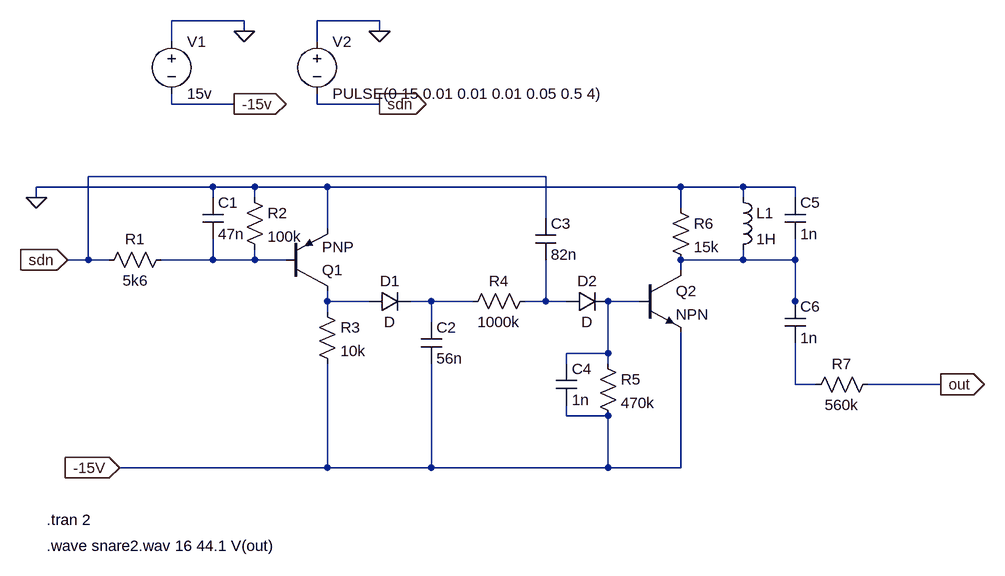
[diagram p0: schematic snare2.asc]
snare2.asc, the LTspice schematic file:
Version 4
SHEET 1 1168 680
WIRE 0 -176 -112 -176
WIRE 208 -176 112 -176
WIRE 0 -160 0 -176
WIRE 208 -160 208 -176
WIRE -112 -144 -112 -176
WIRE 112 -144 112 -176
WIRE -112 -48 -112 -64
WIRE -16 -48 -112 -48
WIRE 112 -48 112 -64
WIRE 208 -48 112 -48
WIRE 464 64 -240 64
WIRE -48 80 -320 80
WIRE 16 80 -48 80
WIRE 128 80 16 80
WIRE 672 80 128 80
WIRE 768 80 672 80
WIRE 848 80 768 80
WIRE -320 96 -320 80
WIRE -48 96 -48 80
WIRE 16 96 16 80
WIRE 768 96 768 80
WIRE 848 96 848 80
WIRE 672 112 672 80
WIRE 464 128 464 64
WIRE 128 144 128 80
WIRE -240 192 -240 64
WIRE -240 192 -272 192
WIRE -208 192 -240 192
WIRE -48 192 -48 160
WIRE -48 192 -128 192
WIRE 16 192 16 176
WIRE 16 192 -48 192
WIRE 64 192 16 192
WIRE 768 192 768 176
WIRE 768 192 672 192
WIRE 848 192 848 160
WIRE 848 192 768 192
WIRE 672 208 672 192
WIRE 128 256 128 240
WIRE 192 256 128 256
WIRE 288 256 256 256
WIRE 352 256 288 256
WIRE 464 256 464 192
WIRE 464 256 432 256
WIRE 496 256 464 256
WIRE 608 256 560 256
WIRE 848 256 848 192
WIRE 128 272 128 256
WIRE 848 272 848 256
WIRE 288 288 288 256
WIRE 560 336 560 256
WIRE 560 336 496 336
WIRE 496 352 496 336
WIRE 560 352 560 336
WIRE 848 384 848 320
WIRE 880 384 848 384
WIRE 1072 384 960 384
WIRE 496 432 496 416
WIRE 560 432 496 432
WIRE 128 512 128 352
WIRE 128 512 -192 512
WIRE 288 512 288 352
WIRE 288 512 128 512
WIRE 560 512 560 432
WIRE 560 512 288 512
WIRE 672 512 672 304
WIRE 672 512 560 512
FLAG -272 192 sdn
IOPIN -272 192 In
FLAG -320 96 0
FLAG -192 512 -15V
IOPIN -192 512 In
FLAG 0 -160 0
FLAG -16 -48 -15v
IOPIN -16 -48 Out
FLAG 208 -160 0
FLAG 208 -48 sdn
IOPIN 208 -48 Out
FLAG 1072 384 out
IOPIN 1072 384 Out
SYMBOL res -112 176 R90
WINDOW 0 0 56 VBottom 2
WINDOW 3 32 56 VTop 2
SYMATTR InstName R1
SYMATTR Value 5k6
SYMBOL cap -64 96 R0
SYMATTR InstName C1
SYMATTR Value 47n
SYMBOL res 0 80 R0
SYMATTR InstName R2
SYMATTR Value 100k
SYMBOL pnp 64 240 M180
SYMATTR InstName Q1
SYMBOL res 112 256 R0
SYMATTR InstName R3
SYMATTR Value 10k
SYMBOL diode 192 272 R270
WINDOW 0 32 32 VTop 2
WINDOW 3 0 32 VBottom 2
SYMATTR InstName D1
SYMBOL cap 272 288 R0
SYMATTR InstName C2
SYMATTR Value 56n
SYMBOL res 448 240 R90
WINDOW 0 0 56 VBottom 2
WINDOW 3 32 56 VTop 2
SYMATTR InstName R4
SYMATTR Value 1000k
SYMBOL cap 448 128 R0
SYMATTR InstName C3
SYMATTR Value 82n
SYMBOL diode 496 272 R270
WINDOW 0 32 32 VTop 2
WINDOW 3 0 32 VBottom 2
SYMATTR InstName D2
SYMBOL res 544 336 R0
SYMATTR InstName R5
SYMATTR Value 470k
SYMBOL cap 480 352 R0
SYMATTR InstName C4
SYMATTR Value 1n
SYMBOL npn 608 208 R0
SYMATTR InstName Q2
SYMBOL res 656 96 R0
SYMATTR InstName R6
SYMATTR Value 15k
SYMBOL ind 752 80 R0
SYMATTR InstName L1
SYMATTR Value 1H
SYMBOL cap 832 96 R0
SYMATTR InstName C5
SYMATTR Value 1n
SYMBOL voltage -112 -160 R0
WINDOW 123 0 0 Left 0
WINDOW 39 0 0 Left 0
SYMATTR InstName V1
SYMATTR Value 15v
SYMBOL voltage 112 -160 R0
WINDOW 123 0 0 Left 0
WINDOW 39 0 0 Left 0
SYMATTR InstName V2
SYMATTR Value PULSE(0 15 0.01 0.01 0.01 0.05 0.5 4)
SYMBOL cap 832 256 R0
SYMATTR InstName C6
SYMATTR Value 1n
SYMBOL res 976 368 R90
WINDOW 0 0 56 VBottom 2
WINDOW 3 32 56 VTop 2
SYMATTR InstName R7
SYMATTR Value 560k
TEXT -304 592 Left 2 !.tran 2
TEXT -304 632 Left 2 !.wave snare2.wav 16 44.1 V(out)

The netlist it stands for:
* snare2.asc
R1 N001 sdn 5k6
C1 0 N001 47n
R2 0 N001 100k
Q1 N003 N001 0 0 PNP
R3 N003 -15V 10k
D1 N003 N004 D
C2 N004 -15V 56n
R4 N005 N004 1000k
C3 sdn N005 82n
D2 N005 N006 D
R5 N006 -15V 470k
C4 N006 -15V 1n
Q2 N002 N006 -15V 0 NPN
R6 0 N002 15k
L1 0 N002 1H
C5 0 N002 1n
V1 0 -15V 15v
V2 0 sdn PULSE(0 15 0.01 0.01 0.01 0.05 0.5 4)
C6 N002 N007 1n
R7 out N007 560k
.model D D
.lib standard.dio
.model NPN NPN
.model PNP PNP
.lib standard.bjt
.tran 2
.wave snare2.wav 16 44.1 V(out)
.backanno
.end